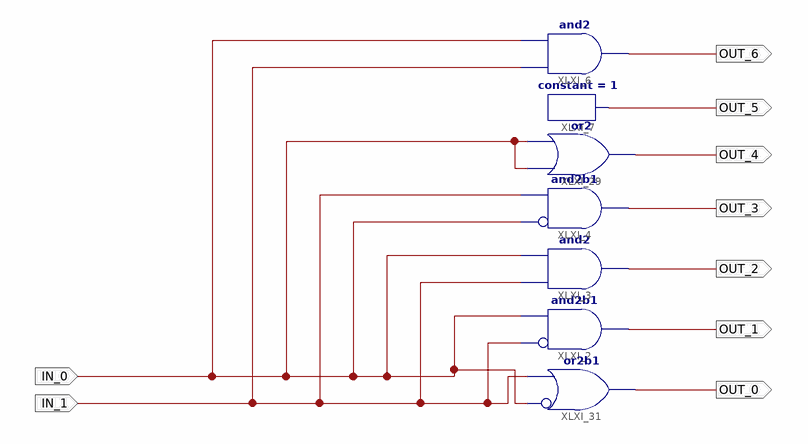
[diagram p0: schematic sheet 1]
// Xilinx ISE schematic MY2TO7DECODER.sch (spartan3a) as structural Verilog: 7 symbols, 9 ports
module MY2TO7DECODER (
  input  IN_1,
  input  IN_0,
  output OUT_0,
  output OUT_1,
  output OUT_2,
  output OUT_3,
  output OUT_6,
  output OUT_5,
  output OUT_4
);

  and XLXI_2 (OUT_1, ~IN_1, IN_0);  // and2b1
  and XLXI_3 (OUT_2, IN_1, IN_0);
  and XLXI_4 (OUT_3, ~IN_0, IN_1);  // and2b1
  constant #(.CValue("1")) XLXI_7 (.O(OUT_5));
  and XLXI_6 (OUT_6, IN_1, IN_0);
  or XLXI_29 (OUT_4, IN_0, IN_0);
  or XLXI_31 (OUT_0, ~IN_0, IN_1);  // or2b1
endmodule
